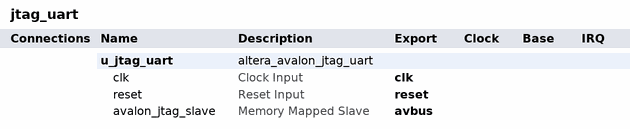
[diagram p0: system contents]
# Platform Designer (Qsys) system jtag_uart, Cyclone 10 LP 10CL025YU256I7G
# Parameters at their usual value, and those the tool derives, are not listed.
package require -exact qsys 20.1
create_system jtag_uart
set_project_property DEVICE_FAMILY {Cyclone 10 LP}
set_project_property DEVICE 10CL025YU256I7G

add_instance u_jtag_uart altera_avalon_jtag_uart 20.1
set_instance_parameter_value u_jtag_uart readBufferDepth 256
set_instance_parameter_value u_jtag_uart simInteractiveOptions NO_INTERACTIVE_WINDOWS
set_instance_parameter_value u_jtag_uart writeBufferDepth 256

# exported interfaces
add_interface avbus avalon slave
set_interface_property avbus EXPORT_OF u_jtag_uart.avalon_jtag_slave
add_interface clk clock sink
set_interface_property clk EXPORT_OF u_jtag_uart.clk
add_interface reset reset sink
set_interface_property reset EXPORT_OF u_jtag_uart.reset

set_interconnect_requirement {$system} qsys_mm.clockCrossingAdapter HANDSHAKE
set_interconnect_requirement {$system} qsys_mm.enableEccProtection FALSE
set_interconnect_requirement {$system} qsys_mm.insertDefaultSlave FALSE
set_interconnect_requirement {$system} qsys_mm.maxAdditionalLatency 1

save_system jtag_uart.qsys
